# Altium project reference-cell.PrjPcb
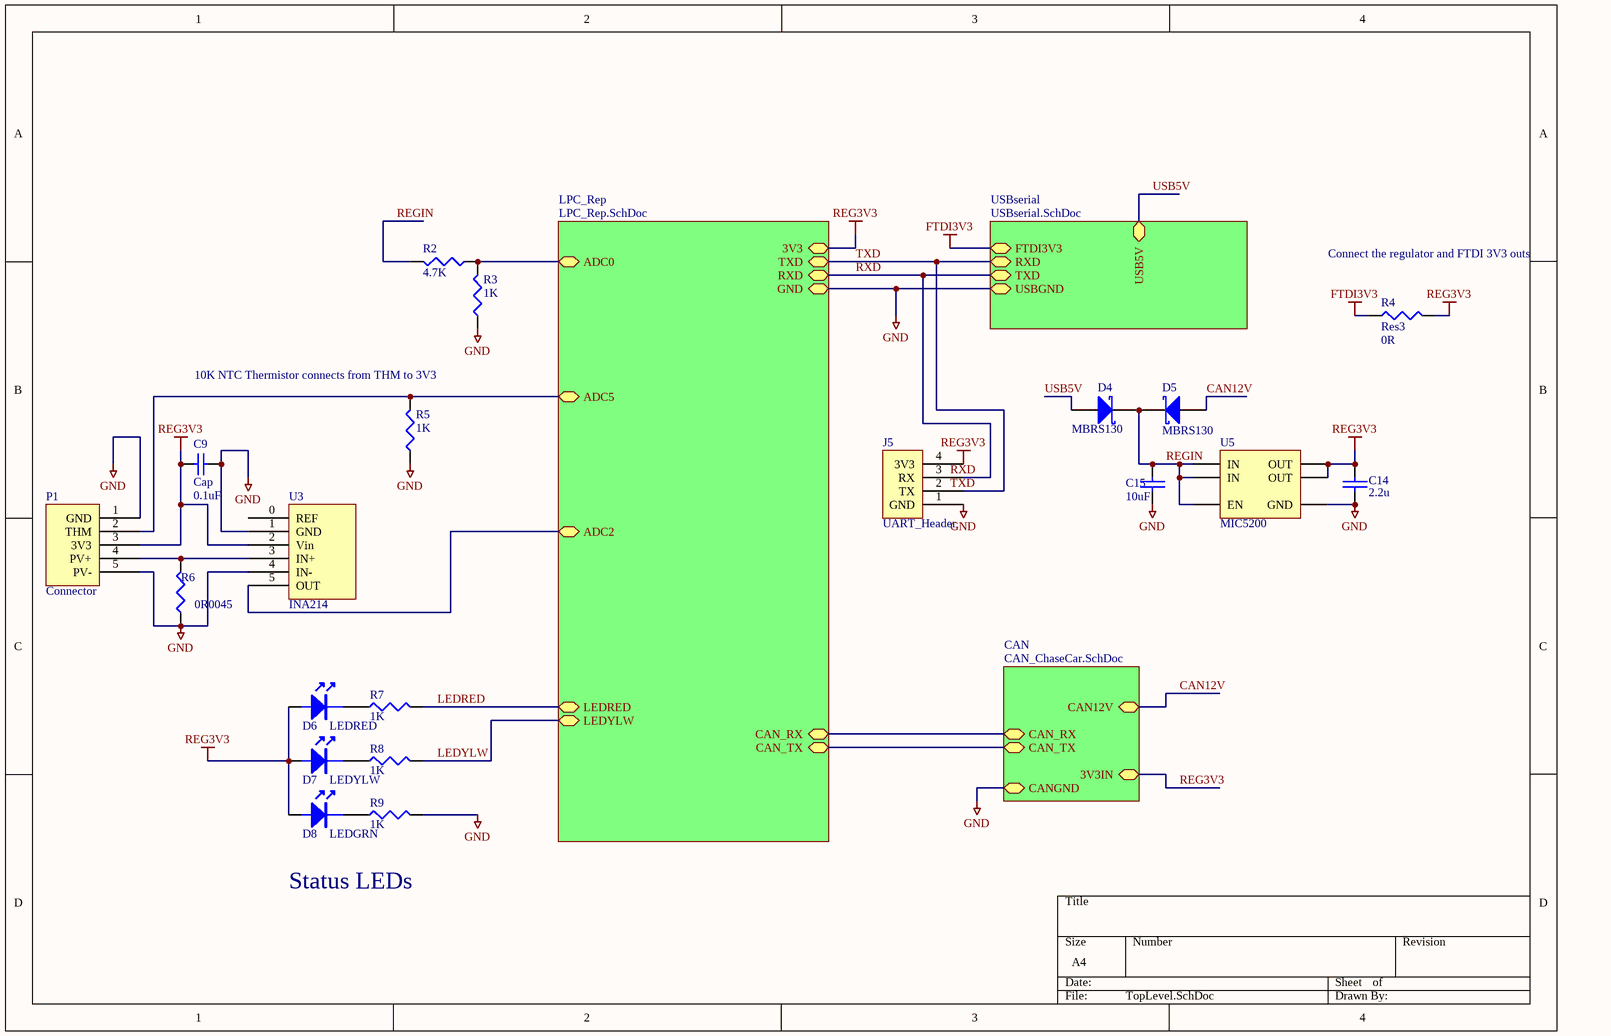
[diagram p0: TopLevel.SchDoc]
4 sheets, 50 parts. Net scope: hierarchical (ports join the sheet entries above them; power ports are global).
Board files: PVPanel.PcbDoc, SunRefPCB.PcbDoc, USBPanel.PcbDoc
Sheets:
  TopLevel.SchDoc
    LPC_Rep = LPC_Rep.SchDoc
    USBserial = USBserial.SchDoc
    CAN = CAN_ChaseCar.SchDoc

## Sheet TopLevel.SchDoc
size A4

### Parts
C9  Cap  value 0.1uF  [0603]
C14  2.2u  [0603]
C15  value 10uF  [0805]  (hidden comment: 10u)
D4  MBRS130  [SMB]
D5  MBRS130  [SMB]
D6  LEDRED  [0805LED]
D7  LEDYLW  [0805LED]
D8  LEDGRN  [0805LED]
J5  UART_Header  [IDC4]
P1  Connector  [TermBlock5]
R2  4.7K  [0603]
R3  1K  [0603]
R4  Res3  value 0R  [0603]
R5  1K  [0603]
R6  0R0045  [1206]
R7  1K  [0603]
R8  1K  [0603]
R9  1K  [0603]
U3  INA214  [SOP6 - INA214]
U5  MIC5200  [SO8]

### Sub-sheets
CAN = CAN_ChaseCar.SchDoc: CAN12V, CAN_RX, CAN_TX, 3V3IN, CANGND
LPC_Rep = LPC_Rep.SchDoc: ADC0, ADC5, TXD, RXD, LEDRED, LEDYLW, ADC2, 3V3, GND, CAN_TX, CAN_RX
USBserial = USBserial.SchDoc: RXD, TXD, FTDI3V3, USBGND, USB5V

### Nets
FTDI3V3: R4.1 ; sheet USBserial/FTDI3V3
GND: C9.2 C14.1 C15.2 J5.1(GND) P1.1(GND) P1.5(PV-) R3.1 R5.1 R6.1 R9.2 U3.1(GND) U3.4(IN-) U5.4(GND) ; sheet LPC_Rep/GND, sheet USBserial/USBGND, sheet CAN/CANGND  [project net CANGND]
REG3V3: C9.1 C14.2 D6.A D7.A D8.A J5.4(3V3) P1.3(3V3) R4.2 U3.2(Vin) U5.1(OUT) U5.2(OUT) ; sheet LPC_Rep/3V3, sheet CAN/3V3IN
USB5V: D4.A ; sheet USBserial/USB5V
CAN12V: D5.A ; sheet CAN/CAN12V
LEDRED: R7.2 ; sheet LPC_Rep/LEDRED
LEDYLW: R8.2 ; sheet LPC_Rep/LEDYLW
REGIN: C15.1 D4.K D5.K R2.2 U5.5(EN) U5.7(IN) U5.8(IN)
RXD: J5.3(RX) ; sheet LPC_Rep/RXD, sheet USBserial/TXD
TXD: J5.2(TX) ; sheet LPC_Rep/TXD, sheet USBserial/RXD
NetD6_K: D6.K R7.1
NetD7_K: D7.K R8.1
NetD8_K: D8.K R9.1
NetP1_2: P1.2(THM) R5.2 ; sheet LPC_Rep/ADC5
NetP1_4: P1.4(PV+) R6.2 U3.3(IN+)
NetR2_1: R2.1 R3.2 ; sheet LPC_Rep/ADC0
NetU1_19: sheet LPC_Rep/CAN_RX, sheet CAN/CAN_RX
NetU1_20: sheet LPC_Rep/CAN_TX, sheet CAN/CAN_TX
NetU1_42: U3.5(OUT) ; sheet LPC_Rep/ADC2

Not connected (* = marked no-connect by the designer): U3 0(REF)

### Notes on the sheet
- Connect the regulator and FTDI 3V3 outs
- (near R5) 10K NTC Thermistor connects from THM to 3V3
- Status LEDs
- Labels drawn without touching a wire or pin: RXD, TXD

### Library data of the parts
C9 = Cap: Capacitor; Published: 8-Jun-2000; LatestRevisionDate: 17-Jul-2002; LatestRevisionNote: Re-released for DXP Platform.; PackageReference: RAD-0.3; Publisher: Altium Limited; PackageDescription: Radial Cap, Thru-Hole; 2 Leads; 0.3 in Pin Spacing
C14 = CAP: Capacitor; Something: 0.938; Value: 2.2uF; Needed?: Farnell; RS: 643-3771; RS Price: 0.07; Supplier: Farnell.; Farnell: 1683525; Farnell Price: 0.04
C15 = CAP: Capacitor; Needed?: Farnell; Farnell: 1844290; Farnell Price: 0.15
D4 D5 = D SCHOTTKY: Schottky Diode; Needed?: Unsure - RS; RS: 625-5278; RS Price: 0.39; Revision: July-2002: Re-released for DXP Platform.; Farnell: 708-150; Farnell Price: 2.09
D6-D8 = LED
J5 = UART_Header: Needed?: NO - Common
P1 = CONN
R2 R3 R5-R9 = RES1: Resistor; Order#: 9331697; Supplier: Farnell; Price: 0.05
R4 = Res3: Resistor; Published: 8-Jun-2000; LatestRevisionDate: 29-May-2009; LatestRevisionNote: IPC-7351 Footprint Added.; PackageReference: J1-0603; Publisher: Altium Limited; PackageDescription: Chip Resistor
U5 = MIC5200: MIC5200 - SO8; Needed?: Farnell; Part Field 2: 2.00; Part Field 3: Computer Science and Engineering; Part Field 4: David Johnson; Farnell: 1213488; Farnell Price: 3.62

## Sheet LPC_Rep.SchDoc
size A4; Organization: UNSW Solar Racing Team; Address3: UNSW; Address4: Sydney NSW 2052; Address2: Electrical Engineering; Address1: Rm 109
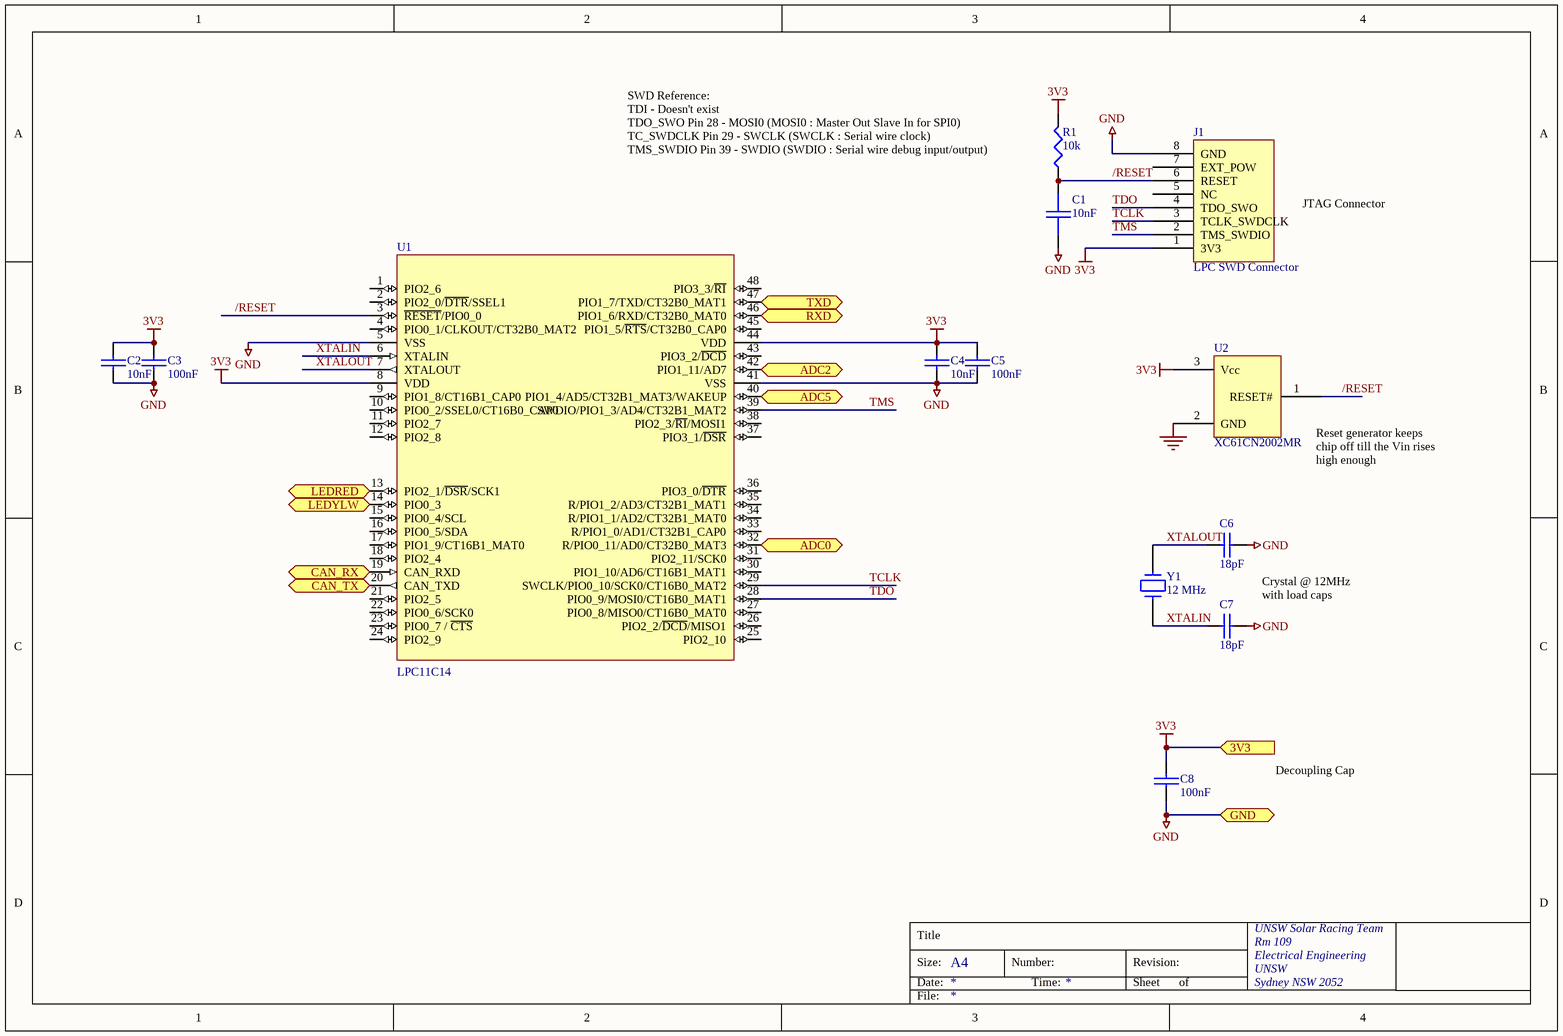
[diagram p1: LPC_Rep.SchDoc]

### Parts
C1  10nF  [0603]
C2  10nF  [0603]
C3  100nF  [0603]
C4  10nF  [0603]
C5  100nF  [0603]
C6  18pF  [0603]
C7  18pF  [0603]
C8  100nF  [0603]
J1  LPC SWD Connector  [IDC8]
R1  10k  [0603]
U1  LPC11C14  [TSQFP50P900X900-48N]
U2  XC61CN2002MR  [SOT23-3]
Y1  12 MHz  [HC49/4H]

### Ports
3V3, ADC0, ADC2, ADC5, CAN_RX, CAN_TX, GND, LEDRED, LEDYLW, RXD (bidir), TXD (bidir)

### Nets
3V3: C2.2 C3.2 C4.2 C5.2 C8.1 J1.1(3V3) R1.2 U1.8(VDD) U1.44(VDD) U2.3(Vcc) ; port 3V3  [project net REG3V3]
GND: C1.2 C2.1 C3.1 C4.1 C5.1 C6.2 C7.2 C8.2 J1.8(GND) U1.5(VSS) U1.41(VSS) U2.2(GND) ; port GND  [project net CANGND]
/RESET: C1.1 J1.6(RESET) R1.1 U1.3(~{RESET}/PIO0_0) U2.1(RESET#)
LEDRED: U1.13(PIO2_1/~{DSR}/SCK1) ; port LEDRED
LEDYLW: U1.14(PIO0_3) ; port LEDYLW
RXD: U1.46(PIO1_6/RXD/CT32B0_MAT0) ; port RXD
TCLK: J1.3(TCLK_SWDCLK) U1.29(SWCLK/PIO0_10/SCK0/CT16B0_MAT2)
TDO: J1.4(TDO_SWO) U1.28(PIO0_9/MOSI0/CT16B0_MAT1)
TMS: J1.2(TMS_SWDIO) U1.39(SWDIO/PIO1_3/AD4/CT32B1_MAT2)
TXD: U1.47(PIO1_7/TXD/CT32B0_MAT1) ; port TXD
XTALIN: C7.1 U1.6(XTALIN) Y1.1
XTALOUT: C6.1 U1.7(XTALOUT) Y1.2
NetP1_2: U1.40(PIO1_4/AD5/CT32B1_MAT3/WAKEUP) ; port ADC5
NetR2_1: U1.32(R/PIO0_11/AD0/CT32B0_MAT3) ; port ADC0
NetU1_19: U1.19(CAN_RXD) ; port CAN_RX
NetU1_20: U1.20(CAN_TXD) ; port CAN_TX
NetU1_42: U1.42(PIO1_11/AD7) ; port ADC2

Not connected (* = marked no-connect by the designer): J1 5(NC) 7(EXT_POW); U1 1(PIO2_6) 2(PIO2_0/~{DTR}/SSEL1) 4(PIO0_1/CLKOUT/CT32B0_MAT2) 9(PIO1_8/CT16B1_CAP0) 10(PIO0_2/SSEL0/CT16B0_CAP0) 11(PIO2_7) 12(PIO2_8) 15(PIO0_4/SCL) 16(PIO0_5/SDA) 17(PIO1_9/CT16B1_MAT0) 18(PIO2_4) 21(PIO2_5) 22(PIO0_6/SCK0) 23(PIO0_7_/_~{CTS}) 24(PIO2_9) 25(PIO2_10) 26(PIO2_2/~{DCD}/MISO1) 27(PIO0_8/MISO0/CT16B0_MAT0) 30(PIO1_10/AD6/CT16B1_MAT1) 31(PIO2_11/SCK0) 33(R/PIO1_0/AD1/CT32B1_CAP0) 34(R/PIO1_1/AD2/CT32B1_MAT0) 35(R/PIO1_2/AD3/CT32B1_MAT1) 36(PIO3_0/~{DTR}) 37(PIO3_1/~{DSR}) 38(PIO2_3/~{RI}/MOSI1) 43(PIO3_2/~{DCD}) 45(PIO1_5/~{RTS}/CT32B0_CAP0) 48(PIO3_3/~{RI})

### Notes on the sheet
- SWD Reference:
  TDI - Doesn't exist
  TDO_SWO Pin 28 - MOSI0 (MOSI0 : Master Out Slave In for SPI0)
  TC_SWDCLK Pin 29 - SWCLK (SWCLK : Serial wire clock)
  TMS_SWDIO Pin 39 - SWDIO (SWDIO : Serial wire debug input/output)
- JTAG Connector
- (near U2) Reset generator keeps chip off till the Vin rises high enough
- Crystal @ 12MHz with load caps
- Decoupling Cap
- Title
- Size:
- Date:
- A4
- Number:
- Time:
- Revision:
- Sheet
- of
- File:

### Library data of the parts
C1-C8 = CAP: Capacitor
  C1: Farnell: 722-236; Price: 0.15
  C2-C5 C8: Farnell: 753-567; Price: 0.31
  C6 C7: Farnell: 721-992; Price: 0.11
J1 = LPCLink_Connector: Farnell: 511-808; Price: 1.32
R1 = RES1: Resistor; Farnell: 612-601; Price: 0.11
U1 = LPC11C14_Full: Farnell: NA
U2 = XC61F: SOT23 reset generator; Farnell: NA
Y1 = CRYSTAL: Farnell: 485-111; Price: 3.38

## Sheet USBserial.SchDoc
size A4
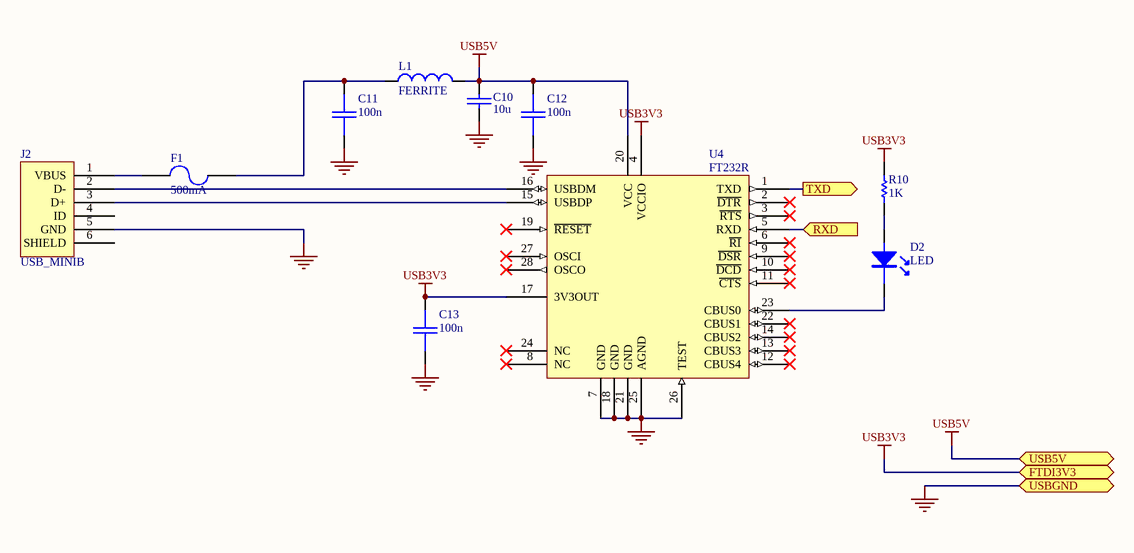
[diagram p2: USBserial.SchDoc]

### Parts
C10  10u  [0805]
C11  100n  [0603]
C12  100n  [0603]
C13  100n  [0603]
D2  LED  [0805LED]
F1  500mA  [LITTELFUSE-154]
J2  USB_MINIB  [USB/SM0.8-6H5]
L1  FERRITE  [0603]
R10  1K  [0603]
U4  FT232R  [SSOP28w]

### Ports
FTDI3V3, RXD (in), TXD (out), USB5V, USBGND

### Nets
USB3V3: C13.1 R10.2 U4.4(VCCIO) U4.17(3V3OUT) ; port FTDI3V3  [project net FTDI3V3]
USB5V: C10.2 C12.1 L1.2 U4.20(VCC) ; port USB5V
USBGND: C10.1 C11.2 C12.2 C13.2 J2.5(GND) U4.7(GND) U4.18(GND) U4.21(GND) U4.25(AGND) U4.26(TEST) ; port USBGND  [project net CANGND]
RXD: U4.1(TXD) ; port TXD
TXD: U4.5(RXD) ; port RXD
NetC11_1: C11.1 F1.2 L1.1
NetD2_A: D2.A R10.1
NetD2_K: D2.K U4.23(CBUS0)
NetF1_1: F1.1 J2.1(VBUS)
NetJ2_2: J2.2(D-) U4.16(USBDM)
NetJ2_3: J2.3(D+) U4.15(USBDP)

Not connected (* = marked no-connect by the designer): J2 4(ID) 6(SHIELD); U4 2(~{DTR})* 3(~{RTS})* 6(~{RI})* 8(NC)* 9(~{DSR})* 10(~{DCD})* 11(~{CTS})* 12(CBUS4)* 13(CBUS3)* 14(CBUS2)* 19(~{RESET})* 22(CBUS1)* 24(NC)* 27(OSCI)* 28(OSCO)*

### Library data of the parts
C10-C13 = CAP: Capacitor
  C10: Element14: 1458902RL; Element14 Price: 0.69
  C11-C13: Element14: 9406140; Element14 Price: 0.13
F1 = FUSE2: Fuse; Element14 Price: 4.60 (min 10); Element14 (low stock): 9943625(holder+fuse); Digikey: F1301CT-ND(holder+fuse); Digikey Price: 3.96
J2 = USB_miniB_SMT: USB Mini B Connector; Element14: 9786473; Element14 Price: $3.08
L1 = INDUCTOR: Manufacturer: Generic Components; Revision: July-2002: Re-released for DXP Platform.; Element14: 1308773; Element14 Price: 0.72
R10 = Res Semi: Semiconductor Resistor; Value: 1K; Element14: Stock
U4 = FT232R: USB UART IC; Element14: 1146032; Cost: 7.94

## Sheet CAN_ChaseCar.SchDoc
size A4
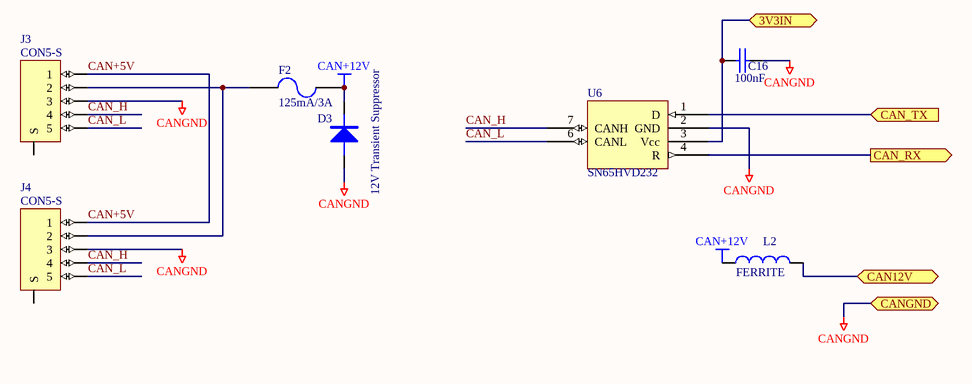
[diagram p3: CAN_ChaseCar.SchDoc]

### Parts
C16  100nF  [0603]
D3  12V Transient Suppressor  [SMA]
F2  125mA/3A  [LITTELFUSE-154]
J3  CON5-S  [TRIAD5F]
J4  CON5-S  [TRIAD5F]
L2  FERRITE  [0603]
U6  SN65HVD232  [SO8]

### Ports
3V3IN, CAN12V, CAN_RX (out), CAN_TX (in), CANGND

### Nets
CAN+12V: D3.K F2.2 L2.1
CANGND: C16.1 D3.A J3.3 J4.3 U6.2(GND) ; port CANGND
REG3V3: C16.2 U6.3(Vcc) ; port 3V3IN
CAN12V: L2.2 ; port CAN12V
CAN+5V: J3.1 J4.1
CAN_H: J3.4 J4.4 U6.7(CANH)
CAN_L: J3.5 J4.5 U6.6(CANL)
NetF2_1: F2.1 J3.2 J4.2
NetU1_19: U6.4(R) ; port CAN_RX
NetU1_20: U6.1(D) ; port CAN_TX

Not connected (* = marked no-connect by the designer): J3 0(S); J4 0(S)

### Library data of the parts
C16 = CAP: Capacitor; Needed?: NO - HW LAB; Value: 100nF
D3 = DIODE: Needed?: NO - Workshop; Farnell: 302-3096; Farnell Price: 1.25
F2 = FUSE2: Fuse; Needed?: NO - Workshop; Farnell: 664-893; Other Info: www.littelfuse.com; Farnell Price: 5.67
J3 J4 = CON5-S: Connector, 2 pin, with shield @ S; Needed?: NO - Workshop; Farnell Price: 19.32
L2 = INDUCTOR: Manufacturer: Generic Components; Revision: July-2002: Re-released for DXP Platform.; Element14: 1308773; Element14 Price: 0.72
U6 = SN65HVD232: 3.3V CAN Transciever; Needed?: Unsure - RS; RS: 461-9771; RS Price: 3.81; Farnell: 1103107; Farnell Price: 5.10

## Nets that join several sheets
CANGND: TopLevel (13 pins), LPC_Rep (12 pins), USBserial (10 pins), CAN_ChaseCar (5 pins)
FTDI3V3: TopLevel (R4.1), USBserial (C13.1 R10.2 U4.4 U4.17)
REG3V3: TopLevel (11 pins), LPC_Rep (10 pins), CAN_ChaseCar (C16.2 U6.3)
USB5V: TopLevel (D4.A), USBserial (C10.2 C12.1 L1.2 U4.20)
CAN12V: TopLevel (D5.A), CAN_ChaseCar (L2.2)
LEDRED: TopLevel (R7.2), LPC_Rep (U1.13)
LEDYLW: TopLevel (R8.2), LPC_Rep (U1.14)
NetP1_2: TopLevel (P1.2 R5.2), LPC_Rep (U1.40)
NetR2_1: TopLevel (R2.1 R3.2), LPC_Rep (U1.32)
NetU1_19: LPC_Rep (U1.19), CAN_ChaseCar (U6.4)
NetU1_20: LPC_Rep (U1.20), CAN_ChaseCar (U6.1)
NetU1_42: TopLevel (U3.5), LPC_Rep (U1.42)
RXD: TopLevel (J5.3), LPC_Rep (U1.46), USBserial (U4.1)
TXD: TopLevel (J5.2), LPC_Rep (U1.47), USBserial (U4.5)